# EAGLE design dSPLIT_fp_00 (EAGLE 6.5.0)
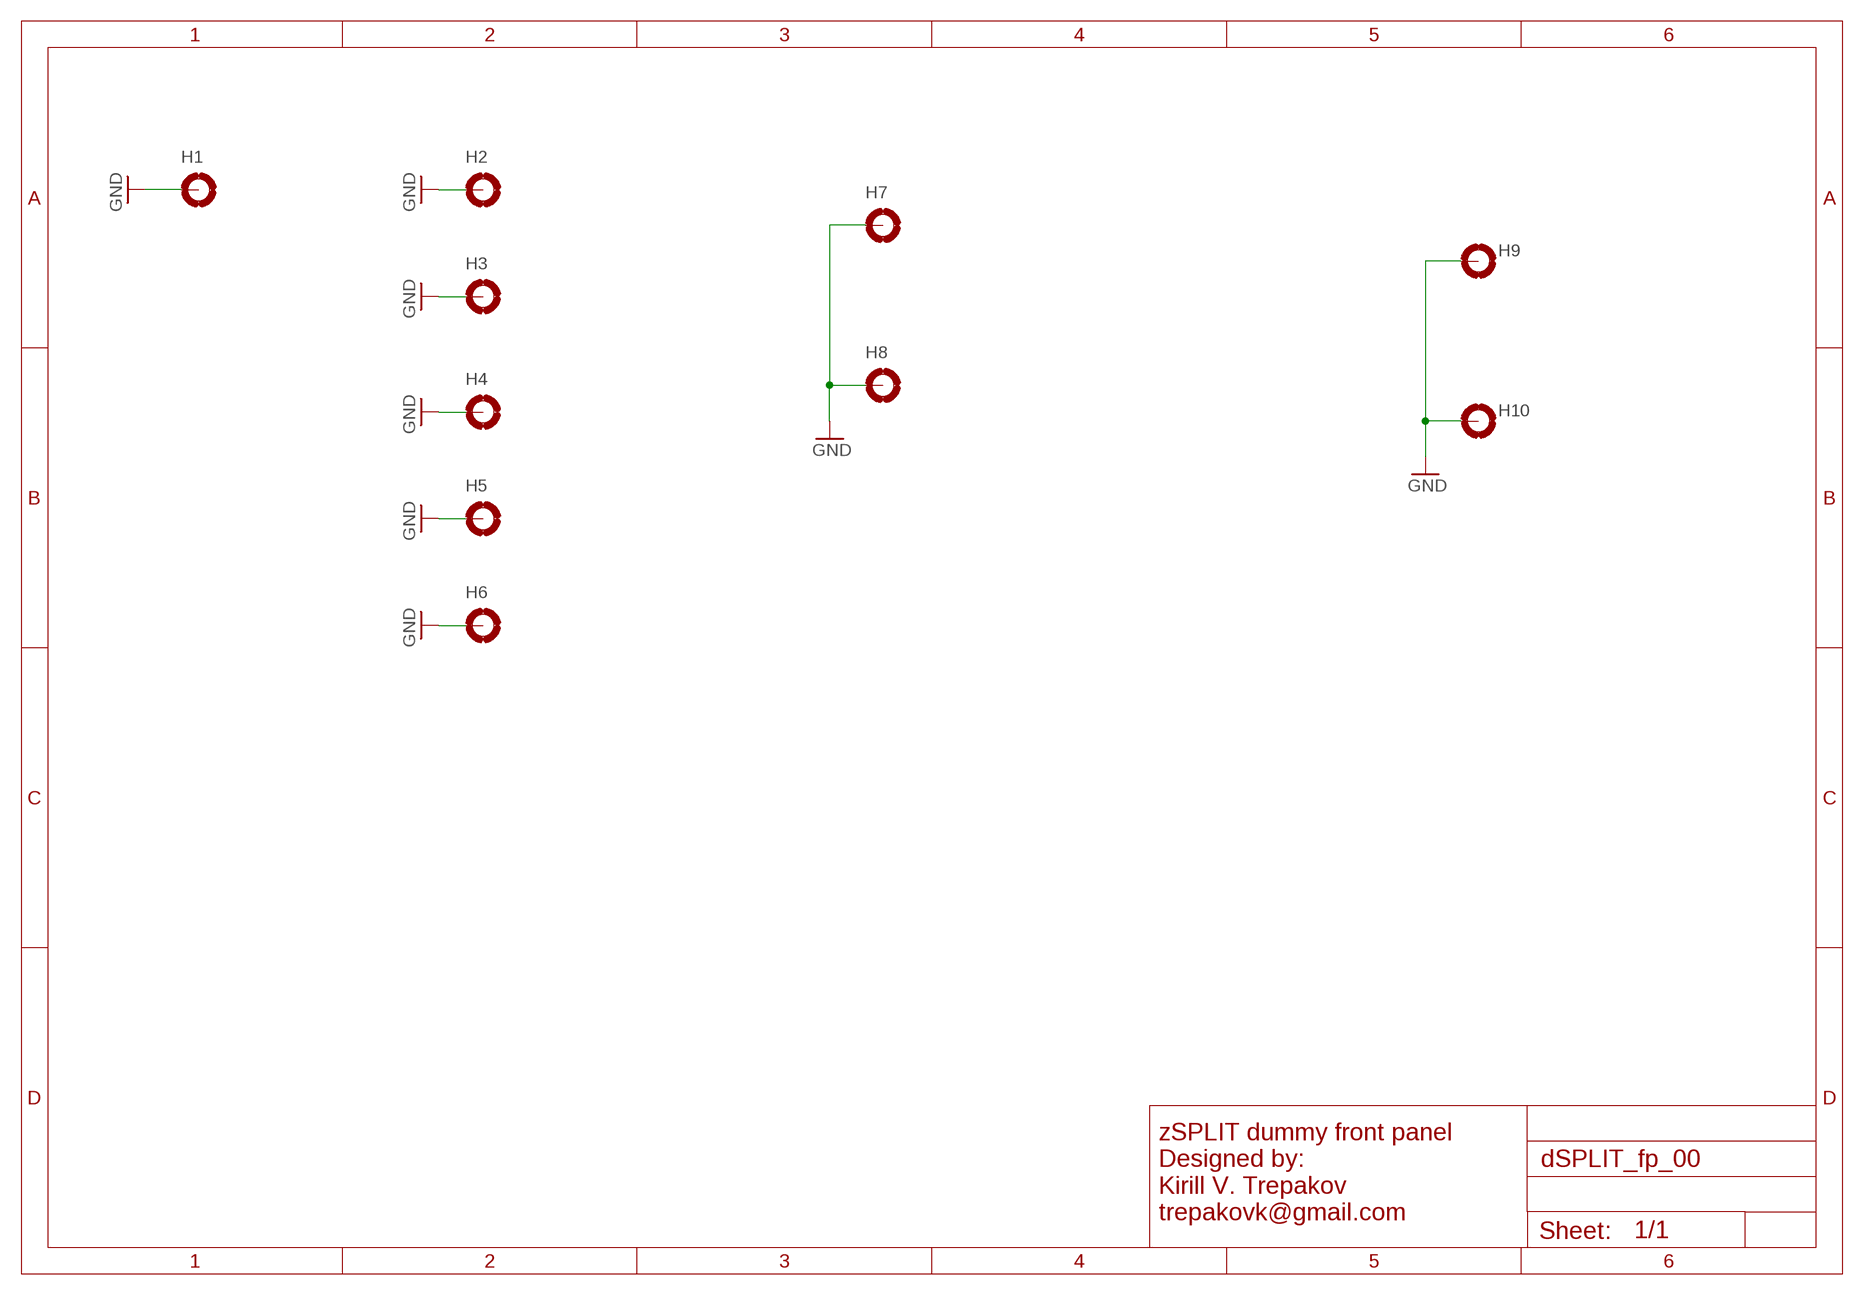
[diagram p0: schematic, sheet 1]

## Parts
H1  MOUNT-PAD-ROUND6.223_OUT  [6.223-PAD_CLEAR]
H2  MOUNT-PAD-ROUND6.223_IN_1  [6.223-PAD_FILL]
H3  MOUNT-PAD-ROUND6.223_IN_1  [6.223-PAD_FILL]
H4  MOUNT-PAD-ROUND6.223_IN_1  [6.223-PAD_FILL]
H5  MOUNT-PAD-ROUND6.223_IN_1  [6.223-PAD_FILL]
H6  MOUNT-PAD-ROUND6.223_IN_1  [6.223-PAD_FILL]
H7  MOUNT-PAD-ROUNDX2  [6.223-PAD_X2]
H8  MOUNT-PAD-ROUNDX4  [6.223-PAD_X4]
H9  MOUNT-PAD-LONG3.2  [3,2-PAD_L]
H10  MOUNT-PAD-LONG3.2  [3,2-PAD_L]

## Nets
GND: H1.B6,223(MOUNT) H2.B6,223(MOUNT) H3.B6,223(MOUNT) H4.B6,223(MOUNT) H5.B6,223(MOUNT) H6.B6,223(MOUNT) H7.B6,223(MOUNT) H8.B6,223(MOUNT) H9.B3,2(MOUNT) H10.B3,2(MOUNT)

## Notes on the sheet
- zSPLIT dummy front panel
  Designed by:
  Kirill V. Trepakov
  trepakovk@gmail.com

## Library data of the parts
H1-H8 = _motovilo_holes:MOUNT-PAD-ROUND: MOUNTING PAD, round
H9 H10 = _motovilo_holes:MOUNT-PAD-LONG: MOUNTING PAD, long

## Board
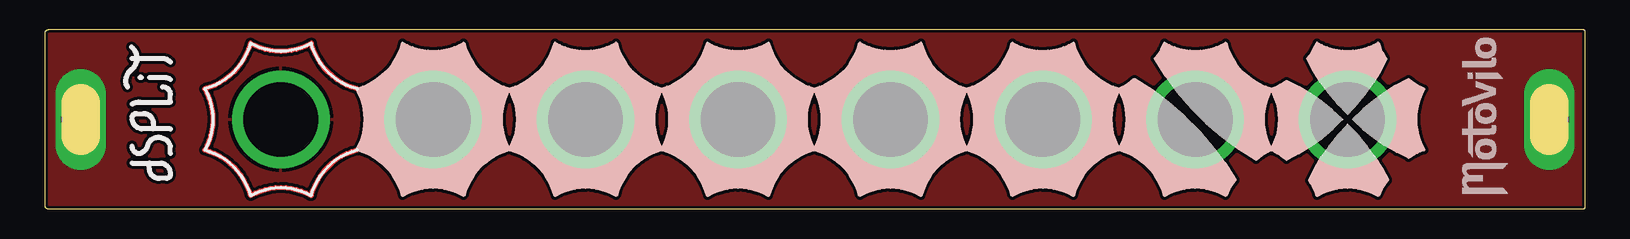
[diagram p1: board, top side]
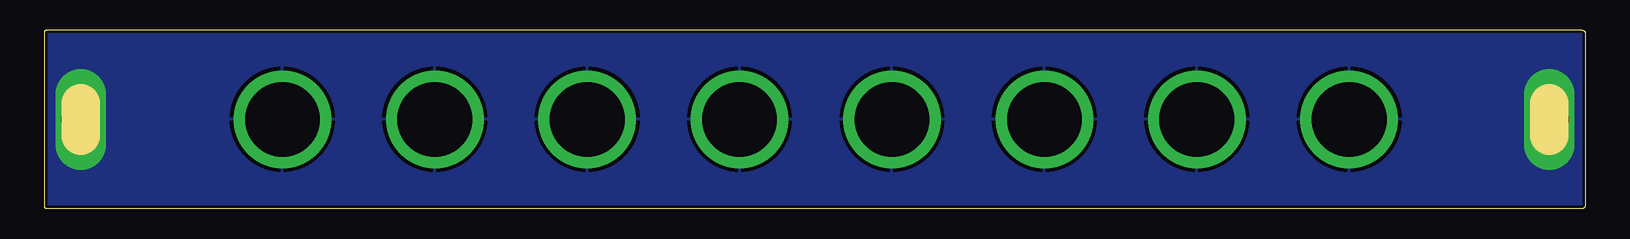
[diagram p2: board, bottom side, seen from below]

Size 128.4 x 14.9 mm. Coordinates in mm from the lower left corner, seen from the top.
Outline: 0,14.61 0,0.32 arc90 0.32,0 128.21,0 arc90 128.4,0.19 128.4,14.77 arc90 128.27,14.9 0.29,14.9 arc90 0,14.61
Copper layers (1*16): Top 0.035mm / dielectric 1.5mm / Bottom 0.035mm
Design rules "ITEADstudio_DRC_z": minimum track width 6mil, minimum drill 12mil, track to track 10mil, track to pad 10mil, pad to pad 10mil, via to via 10mil, smd to smd 0mil, copper to edge 10mil, drill to drill 10mil, minimum pad ring 10mil, minimum via ring 6mil, stop-mask expansion 2mil, vias tented up to drill 100mil, thermal gap 12mil

### Footprints (pad centres in the part's own frame; a part is rotated, then mirrored left to right if it is on the bottom)
6.223-PAD_CLEAR = drill 6.223 pad 8.128: B6,223 0,0
6.223-PAD_FILL = drill 6.223 pad 8.128: B6,223 0,0
6.223-PAD_X2 = drill 6.223 pad 8.128: B6,223 0,0
6.223-PAD_X4 = drill 6.223 pad 8.128: B6,223 0,0
3,2-PAD_L = drill 3.2 pad 3.81 long: B3,2 0,0

### Placement (x,y rotation side)
H1  19.68,7.45 180 top
H2  32.38,7.45 0 top
H3  45.09,7.45 0 top
H4  57.78,7.45 0 top
H5  70.48,7.45 0 top
H6  83.19,7.45 0 top
H7  95.89,7.45 0 top
H8  108.58,7.45 0 top
H9  3,7.45 90 top
H10  125.4,7.45 90 top
U$1  [DSPLIT]  10.48,2.54 90 top
U$2  [LOGO_SPACE_002A]  121.92,1.27 90 top

### Tracks (layer width: path | path; a pad name or v marks a point on that pad's centre or on a via)
GND
  pour Bottom: 0,14.9 128.4,14.9 128.27,0 0,0
  pour Top: 0,14.9 128.4,14.9 128.27,0 0,0

### Text on the board
bDocu: The things you used to own, now they own you.